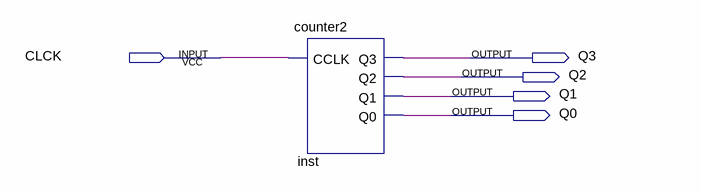
[diagram p0: schematic sheet]
// Quartus schematic Block1.bdf as structural Verilog: 1 symbols, 5 pins
module Block1 (
  input  CLCK,
  output Q3,
  output Q2,
  output Q1,
  output Q0
);

  counter2 inst (.CCLK(CLCK), .Q3(Q3), .Q2(Q2), .Q1(Q1), .Q0(Q0));
endmodule
